# EAGLE design mbavr-1t (EAGLE 8.6.3)
Minimalistic AVR Board
REV: 123
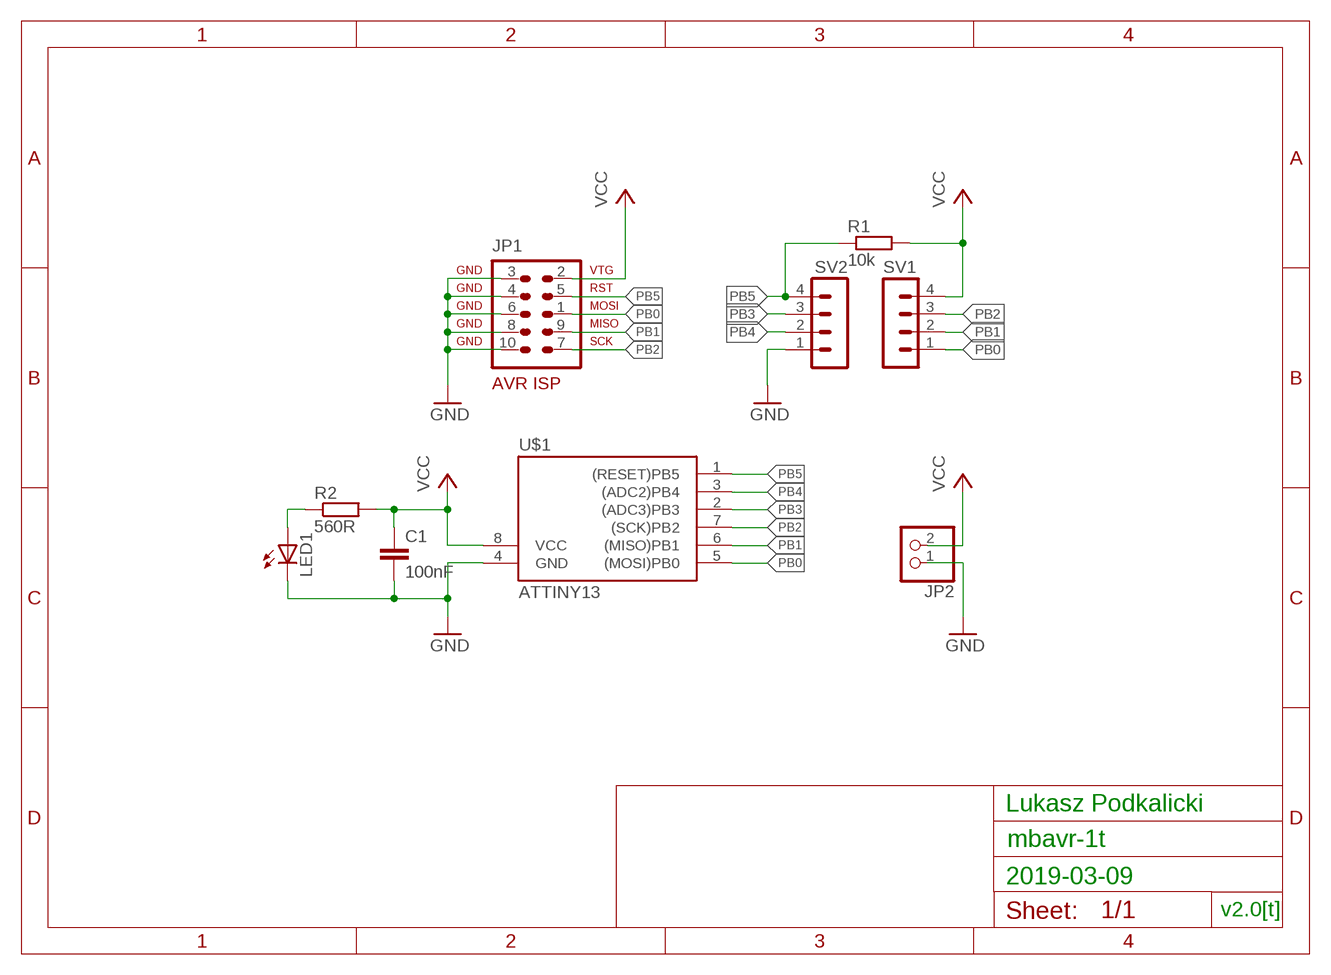
[diagram p0: schematic, sheet 1]

## Parts
C1  100nF  C-EUC1206K  [C1206K]
JP1  AVR-ISP-10  [AVR-ISP-10]
JP2  PINHD-1X2  [1X02]
LED1  LEDSML1206  [SML1206]
R1  10k  R-EU_R1206  [R1206]
R2  560R  R-EU_R1206  [R1206]
SV1  MA04-1  [MA04-1]
SV2  MA04-1  [MA04-1]
U$1  ATTINY13  TINY138P3  [DIL08]

## Nets
GND: C1.2 JP1.3 JP1.4 JP1.6 JP1.8 JP1.10 JP2.1 LED1.C SV2.1 U$1.4(GND)
N$3: LED1.A R2.1
PB0: JP1.1 SV1.1 U$1.5((MOSI)PB0)
PB1: JP1.9 SV1.2 U$1.6((MISO)PB1)
PB2: JP1.7 SV1.3 U$1.7((SCK)PB2)
PB3: SV2.3 U$1.2((ADC3)PB3)
PB4: SV2.2 U$1.3((ADC2)PB4)
PB5: JP1.5 R1.1 SV2.4 U$1.1((RESET)PB5)
VCC: C1.1 JP1.2 JP2.2 R1.2 R2.2 SV1.4 U$1.8(VCC)

## Notes on the sheet
- Lukasz Podkalicki
- 2019-03-09
- v2.0[t]

## Library data of the parts
C1 = rcl:C-EU: CAPACITOR, European symbol
JP1 = avr-7:AVR-ISP-10: AVR ISP-10 Serial Programming Header
JP2 = pinhead:PINHD-1X2: PIN HEADER
LED1 = led:LED: LED OSRAM: - CHIPLED LG R971, LG N971, LY N971, LG Q971, LY Q971, LO R971, LY R971 LH N974, LH R974 LS Q976, LO Q976, LY Q976 LO Q996 - Hyper CHIPLED LW Q18S LB Q993, LB Q99A, LB R99A - SideLED LS A670, LO A670, LY A670, LG A670, LP A670 LB A673, LV A673, LT A673, LW A673 LH A674 LY A675 LS A676, LA A676, LO A676, LY A676, LW A676 LS A679, LY A679, LG A679 - Hyper Micro SIDELED® LS Y876, LA Y876, LO Y876, LY Y876 LT Y87S - SmartLED LW L88C, LW L88S LB L89C, LB L89S, LG L890 LS L89K, LO L89K, LY L89K LS L896, LA L896, LO L896, LY L896 - TOPLED LS T670, LO T670, LY T670, LG T670, LP T670 LSG T670, LSP T670, LSY T670, LOP T670, LYG T670 LG T671, LOG T671, LSG T671 LB T673, LV T673, LT T673, LW T673 LH T674 LS T676, LA T676, LO T676, LY T676, LB T676, LH T676, LSB T676, LW T676 LB T67C, LV T67C, LT T67C, LS T67K, LO T67K, LY T67K, LW E67C LS E67B, LA E67B, LO E67B, LY E67B, LB E67C, LV E67C, LT E67C LW T67C LS T679, LY T679, LG T679 LS T770, LO T770, LY T770, LG T770, LP T770 LB T773, LV T773, LT T773, LW T773 LH T774 LS E675, LA E675, LY E675, LS T675 LS T776, LA T776, LO T776, LY T776, LB T776 LHGB T686 LT T68C, LB T68C - Hyper Mini TOPLED® LB M676 - Mini TOPLED Santana® LG M470 LS M47K, LO M47K, LY M47K Source: http://www.osram.convergy.de LUXEON: - LUMILED® LXK2-PW12-R00, LXK2-PW12-S00, LXK2-PW14-U00, LXK2-PW14-V00 LXK2-PM12-R00, LXK2-PM12-S00, LXK2-PM14-U00 LXK2-PE12-Q00, LXK2-PE12-R00, LXK2-PE12-S00, LXK2-PE14-T00, LXK2-PE14-U00 LXK2-PB12-K00, LXK2-PB12-L00, LXK2-PB12-M00, LXK2-PB14-N00, LXK2-PB14-P00, LXK2-PB14-Q00 LXK2-PR12-L00, LXK2-PR12-M00, LXK2-PR14-Q00, LXK2-PR14-R00 LXK2-PD12-Q00, LXK2-PD12-R00, LXK2-PD12-S00 LXK2-PH12-R00, LXK2-PH12-S00 LXK2-PL12-P00, LXK2-PL12-Q00, LXK2-PL12-R00 Source: www.luxeon.com KINGBRIGHT: KA-3528ASYC Source: www.kingbright.com
R1 R2 = resistor:R-EU_: RESISTOR, European symbol
SV1 SV2 = con-lstb:MA04-1: PIN HEADER; OC_FARNELL: unknown; OC_NEWARK: unknown
U$1 = avr-7:TINY13*

## Board
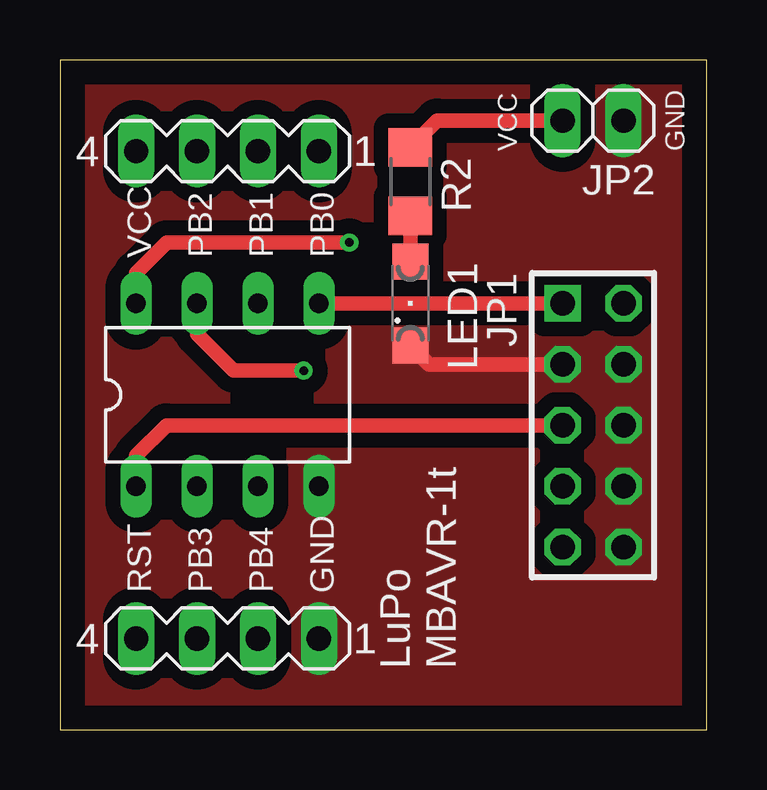
[diagram p1: board, top side]
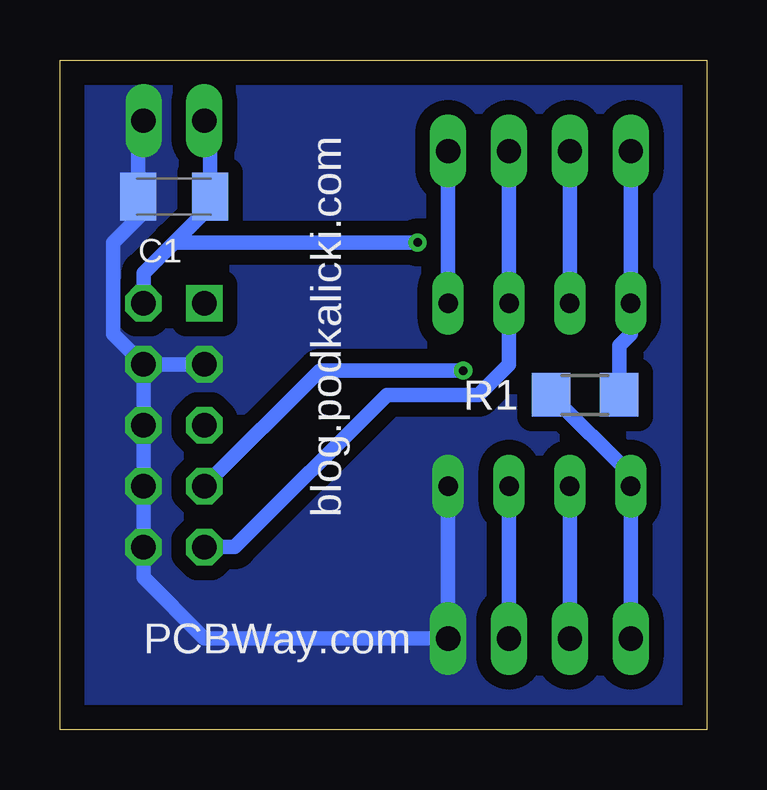
[diagram p2: board, bottom side, seen from below]

Size 26.97 x 27.93 mm. Coordinates in mm from the lower left corner, seen from the top.
Outline: 0,0 26.97,0 26.97,27.93 0,27.93 0,0
Copper layers (1*16): Top 0.035mm / dielectric 1.5mm / Bottom 0.035mm
Design rules "default": minimum track width 10mil, minimum drill 24mil, track to track 8mil, track to pad 8mil, pad to pad 8mil, via to via 8mil, smd to smd 8mil, copper to edge 40mil, drill to drill 8mil, minimum pad ring 10mil, minimum via ring 8mil, stop-mask expansion 4mil, vias tented up to drill 0mil, thermal gap 10mil

### Footprints (pad centres in the part's own frame; a part is rotated, then mirrored left to right if it is on the bottom)
C1206K = smd 1.5 x 2: 1 -1.5,0; 2 1.5,0
AVR-ISP-10 = drill 1.016 square: 1 -5.08,-1.27 | drill 1.016 octagon: 2 -5.08,1.27; 3 -2.54,-1.27; 4 -2.54,1.27; 5 0,-1.27; 6 0,1.27; 7 2.54,-1.27; 8 2.54,1.27; 9 5.08,-1.27; 10 5.08,1.27
1X02 = drill 1.016 long: 1 -1.27,0; 2 1.27,0
SML1206 = smd 1.5 x 1.5: A 1.75,0; C -1.75,0
R1206 = smd 1.6 x 1.803: 1 -1.422,0; 2 1.422,0
MA04-1 = drill 1.016 long: 1 -3.81,0; 2 -1.27,0; 3 1.27,0; 4 3.81,0
DIL08 = drill 0.813 long: 1 -3.81,-3.81; 2 -1.27,-3.81; 3 1.27,-3.81; 4 3.81,-3.81; 5 3.81,3.81; 6 1.27,3.81; 7 -1.27,3.81; 8 -3.81,3.81

### Placement (x,y rotation side)
C1  22.22,22.23 180 bottom
JP1  22.22,12.7 270 top
JP2  22.22,25.4 180 top
LED1  14.61,17.78 90 top
R1  5.08,13.97 0 bottom
R2  14.61,22.86 90 top
SV1  6.98,24.13 180 top
SV2  6.98,3.81 180 top
U$1  6.98,13.97 0 top

### Tracks (layer width: path | path; a pad name or v marks a point on that pad's centre or on a via)
GND
  Top 0.61: LED1.C 15.39,15.24 JP1.3
  Bottom 0.61: JP1.3 JP1.4 | JP1.4 JP1.6 JP1.8 JP1.10 23.5,6.35 20.96,3.81 SV2.1 U$1.4 | JP1.4 24.76,16.51 24.76,20.32 23.5,21.59 23.5,21.99 C1.2 23.72,25.17 JP2.1
  pour Bottom (isolate 0.61, no thermals): -0.63,29.21 27.3,29.21 27.3,-1.27 -0.63,-1.27
  pour Top (isolate 0.61, no thermals): -1.91,30.48 28.57,30.48 28.57,-2.54 -1.91,-2.54
N$3
  Top 0.61: R2.1 LED1.A
PB0
  Top 0.61: JP1.1 U$1.5
  Bottom 0.61: SV1.1 U$1.5
PB1
  Bottom 0.61: SV1.2 U$1.6 8.25,15.24 9.52,13.97 13.34,13.97 19.68,7.62 JP1.9
PB2  (via drill 0.35)
  Top 0.61: U$1.7 5.71,16.51 7.25,14.98 v10.16,14.98
  Bottom 0.61: SV1.3 U$1.7 | JP1.7 16.14,14.98 v10.16,14.98
PB3
  Bottom 0.61: SV2.3 U$1.2
PB4
  Bottom 0.61: SV2.2 U$1.3
PB5
  Top 0.61: U$1.1 3.18,11.43 4.45,12.7 JP1.5
  Bottom 0.61: SV2.4 3.18,10.01 U$1.1 3.18,10.64 R1.1
VCC  (via drill 0.35)
  Top 0.61: v12.07,20.32 4.45,20.32 3.18,19.05 U$1.8 | R2.2 15.72,25.4 JP2.2
  Bottom 0.61: SV1.4 U$1.8 3.18,16.51 3.66,16.03 R1.2 | JP1.2 23.5,19.05 22.22,20.32 | JP2.2 20.72,25.17 C1.1 20.72,21.82 22.22,20.32 | 22.22,20.32 v12.07,20.32

### Text on the board
tNames: VCC | GND | VCC | PB2 | PB1 | PB0 | RST | PB3 | PB4 | GND | LuPo / MBAVR-1t
bNames: blog.podkalicki.com | PCBWay.com
_tNames: JP2 | SV1 | JP1 | U$1 | SV2